# Altium project VETB.PrjPcb
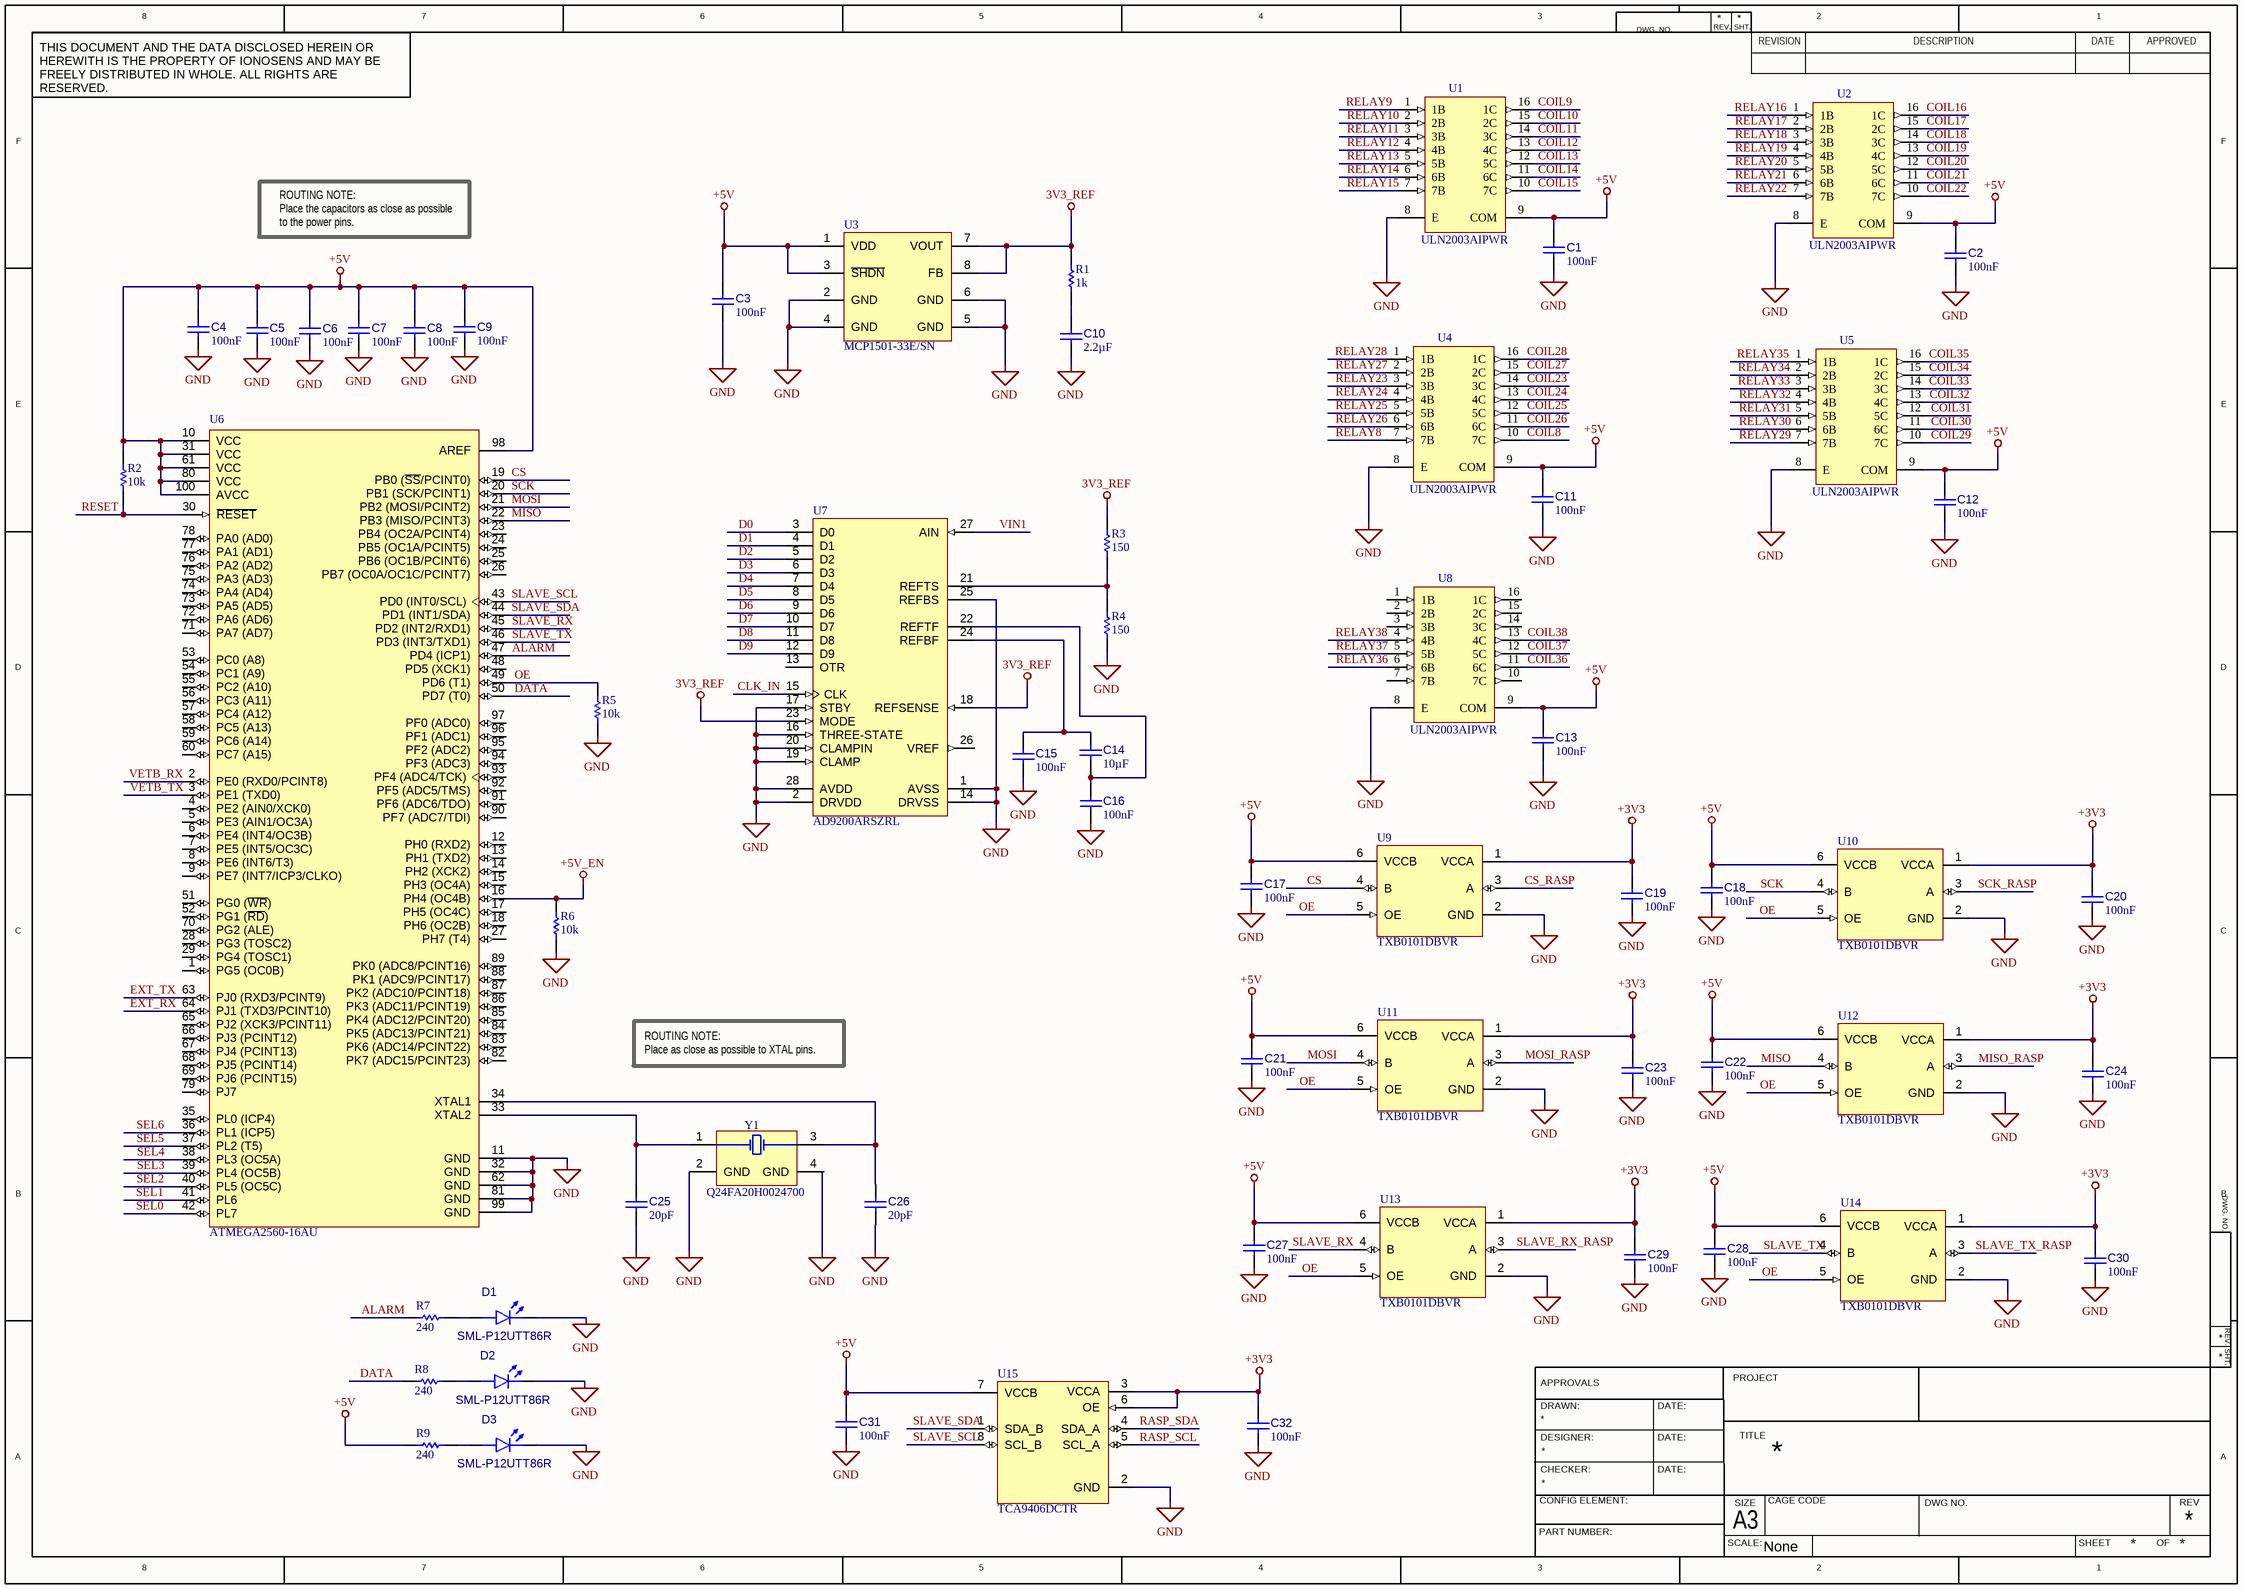
[diagram p0: Sheet1.SchDoc]
3 sheets, 181 parts. Net scope: global (net labels, ports and power ports of the same name join across sheets).
Board file: PCB1.PcbDoc
Sheets:
  Sheet1.SchDoc
  Sheet2.SchDoc
  Sheet3.SchDoc

## Sheet Sheet1.SchDoc
size 420 x 297 mm; Scale: None

### Parts
C1  value 100nF  [CAPC1005X06M]  (hidden comment: CC0402JRX7R7BB104)
C2  value 100nF  [CAPC1005X06M]  (hidden comment: CC0402JRX7R7BB104)
C3  value 100nF  [CAPC1005X06M]  (hidden comment: CC0402JRX7R7BB104)
C4  value 100nF  [CAPC1005X06M]  (hidden comment: CC0402JRX7R7BB104)
C5  value 100nF  [CAPC1005X06M]  (hidden comment: CC0402JRX7R7BB104)
C6  value 100nF  [CAPC1005X06M]  (hidden comment: CC0402JRX7R7BB104)
C7  value 100nF  [CAPC1005X06M]  (hidden comment: CC0402JRX7R7BB104)
C8  value 100nF  [CAPC1005X06M]  (hidden comment: CC0402JRX7R7BB104)
C9  value 100nF  [CAPC1005X06M]  (hidden comment: CC0402JRX7R7BB104)
C10  value 2.2µF  [CAPC2012X14M]  (hidden comment: AC0805KKX7R8BB225)
C11  value 100nF  [CAPC1005X06M]  (hidden comment: CC0402JRX7R7BB104)
C12  value 100nF  [CAPC1005X06M]  (hidden comment: CC0402JRX7R7BB104)
C13  value 100nF  [CAPC1005X06M]  (hidden comment: CC0402JRX7R7BB104)
C14  value 10µF  [CAPC1005X07N]  (hidden comment: CC0402MRX5R6BB106)
C15  value 100nF  [CAPC1005X06M]  (hidden comment: CC0402JRX7R7BB104)
C16  value 100nF  [CAPC1005X06M]  (hidden comment: CC0402JRX7R7BB104)
C17  value 100nF  [CAPC1005X06M]  (hidden comment: CC0402JRX7R7BB104)
C18  value 100nF  [CAPC1005X06M]  (hidden comment: CC0402JRX7R7BB104)
C19  value 100nF  [CAPC1005X06M]  (hidden comment: CC0402JRX7R7BB104)
C20  value 100nF  [CAPC1005X06M]  (hidden comment: CC0402JRX7R7BB104)
C21  value 100nF  [CAPC1005X06M]  (hidden comment: CC0402JRX7R7BB104)
C22  value 100nF  [CAPC1005X06M]  (hidden comment: CC0402JRX7R7BB104)
C23  value 100nF  [CAPC1005X06M]  (hidden comment: CC0402JRX7R7BB104)
C24  value 100nF  [CAPC1005X06M]  (hidden comment: CC0402JRX7R7BB104)
C25  value 20pF  [CAPC1005X06M]  (hidden comment: CC0402JRNPO9BN200)
C26  value 20pF  [CAPC1005X06M]  (hidden comment: CC0402JRNPO9BN200)
C27  value 100nF  [CAPC1005X06M]  (hidden comment: CC0402JRX7R7BB104)
C28  value 100nF  [CAPC1005X06M]  (hidden comment: CC0402JRX7R7BB104)
C29  value 100nF  [CAPC1005X06M]  (hidden comment: CC0402JRX7R7BB104)
C30  value 100nF  [CAPC1005X06M]  (hidden comment: CC0402JRX7R7BB104)
C31  value 100nF  [CAPC1005X06M]  (hidden comment: CC0402JRX7R7BB104)
C32  value 100nF  [CAPC1005X06M]  (hidden comment: CC0402JRX7R7BB104)
D1  SML-P12UTT86R  [DIOC1005X02R]
D2  SML-P12UTT86R  [DIOC1005X02R]
D3  SML-P12UTT86R  [DIOC1005X02R]
R1  value 1k  [RESC1005X04M]  (hidden comment: AC0402FR-071KL)
R2  value 10k  [RESC1005X04M]  (hidden comment: AC0402FR-0710KL)
R3  value 150  [RESC1608X06N]  (hidden comment: AC0603FR-07150RL)
R4  value 150  [RESC1608X06N]  (hidden comment: AC0603FR-07150RL)
R5  value 10k  [RESC1005X04M]  (hidden comment: AC0402FR-0710KL)
R6  value 10k  [RESC1005X04M]  (hidden comment: AC0402FR-0710KL)
R7  value 240  [RESC1005X04M]  (hidden comment: AC0402FR-07240RL)
R8  value 240  [RESC1005X04M]  (hidden comment: AC0402FR-07240RL)
R9  value 240  [RESC1005X04M]  (hidden comment: AC0402FR-07240RL)
U1  ULN2003AIPWR  [TSOP65P640X120-16M]
U2  ULN2003AIPWR  [TSOP65P640X120-16M]
U3  MCP1501-33E/SN  [SOIC127P600X175-8M]
U4  ULN2003AIPWR  [TSOP65P640X120-16M]
U5  ULN2003AIPWR  [TSOP65P640X120-16M]
U6  ATMEGA2560-16AU  [ATML-100A_M]
U7  AD9200ARSZRL  [SOP65P780X198-28N]
U8  ULN2003AIPWR  [TSOP65P640X120-16M]
U9  TXB0101DBVR  [SOT95P280X145-6M]
U10  TXB0101DBVR  [SOT95P280X145-6M]
U11  TXB0101DBVR  [SOT95P280X145-6M]
U12  TXB0101DBVR  [SOT95P280X145-6M]
U13  TXB0101DBVR  [SOT95P280X145-6M]
U14  TXB0101DBVR  [SOT95P280X145-6M]
U15  TCA9406DCTR  [TSOP65P400X130-8M]
Y1  Q24FA20H0024700  [FA-20H]

### Nets
3V3_REF: R1.2 R3.2 U3.7(VOUT) U3.8(FB) U7.18(REFSENSE) U7.23(MODE)
+3V3: C19.2 C20.2 C23.2 C24.2 C29.2 C30.2 C32.2 U9.1(VCCA) U10.1(VCCA) U11.1(VCCA) U12.1(VCCA) U13.1(VCCA) U14.1(VCCA) U15.3(VCCA) U15.6(OE)
+5V: C1.2 C2.2 C3.2 C4.2 C5.2 C6.2 C7.2 C8.2 C9.2 C11.2 C12.2 C13.2 C17.2 C18.2 C21.2 C22.2 C27.2 C28.2 C31.2 R2.2 R9.1 U1.9(COM) U2.9(COM) U3.1(VDD) U3.3(~{SHDN}) U4.9(COM) U5.9(COM) U6.10(VCC) U6.31(VCC) U6.61(VCC) U6.80(VCC) U6.98(AREF) U6.100(AVCC) U8.9(COM) U9.6(VCCB) U10.6(VCCB) U11.6(VCCB) U12.6(VCCB) U13.6(VCCB) U14.6(VCCB) U15.7(VCCB)
+5V_EN: R6.2 U6.16(PH4_(OC4B))
GND: C1.1 C2.1 C3.1 C4.1 C5.1 C6.1 C7.1 C8.1 C9.1 C10.1 C11.1 C12.1 C13.1 C15.1 C16.1 C17.1 C18.1 C19.1 C20.1 C21.1 C22.1 C23.1 C24.1 C25.1 C26.1 C27.1 C28.1 C29.1 C30.1 C31.1 C32.1 D1.1(K) D2.1(K) D3.1(K) R4.1 R5.1 R6.1 U1.8(E) U2.8(E) U3.2(GND) U3.4(GND) U3.5(GND) U3.6(GND) U4.8(E) U5.8(E) U6.11(GND) U6.32(GND) U6.62(GND) U6.81(GND) U6.99(GND) U7.1(AVSS) U7.2(DRVDD) U7.14(DRVSS) U7.16(THREE-STATE) U7.17(STBY) U7.19(CLAMP) U7.20(CLAMPIN) U7.25(REFBS) U7.28(AVDD) U8.8(E) U9.2(GND) U10.2(GND) U11.2(GND) U12.2(GND) U13.2(GND) U14.2(GND) U15.2(GND) Y1.2(GND) Y1.4(GND)
ALARM: R7.1 U6.47(PD4_(ICP1))
CLK_IN: U7.15(CLK)
COIL8: U4.10(7C)
COIL9: U1.16(1C)
COIL10: U1.15(2C)
COIL11: U1.14(3C)
COIL12: U1.13(4C)
COIL13: U1.12(5C)
COIL14: U1.11(6C)
COIL15: U1.10(7C)
COIL16: U2.16(1C)
COIL17: U2.15(2C)
COIL18: U2.14(3C)
COIL19: U2.13(4C)
COIL20: U2.12(5C)
COIL21: U2.11(6C)
COIL22: U2.10(7C)
COIL23: U4.14(3C)
COIL24: U4.13(4C)
COIL25: U4.12(5C)
COIL26: U4.11(6C)
COIL27: U4.15(2C)
COIL28: U4.16(1C)
COIL29: U5.10(7C)
COIL30: U5.11(6C)
COIL31: U5.12(5C)
COIL32: U5.13(4C)
COIL33: U5.14(3C)
COIL34: U5.15(2C)
COIL35: U5.16(1C)
COIL36: U8.11(6C)
COIL37: U8.12(5C)
COIL38: U8.13(4C)
CS: U6.19(PB0_(~{SS}/PCINT0)) U9.4(B)
CS_RASP: U9.3(A)
D0: U7.3(D0)
D1: U7.4(D1)
D2: U7.5(D2)
D3: U7.6(D3)
D4: U7.7(D4)
D5: U7.8(D5)
D6: U7.9(D6)
D7: U7.10(D7)
D8: U7.11(D8)
D9: U7.12(D9)
DATA: R8.1 U6.50(PD7_(T0))
EXT_RX: U6.64(PJ1_(TXD3/PCINT10))
EXT_TX: U6.63(PJ0_(RXD3/PCINT9))
MISO: U6.22(PB3_(MISO/PCINT3)) U12.4(B)
MISO_RASP: U12.3(A)
MOSI: U6.21(PB2_(MOSI/PCINT2)) U11.4(B)
MOSI_RASP: U11.3(A)
OE: R5.2 U6.49(PD6_(T1)) U9.5(OE) U10.5(OE) U11.5(OE) U12.5(OE) U13.5(OE) U14.5(OE)
RASP_SCL: U15.5(SCL_A)
RASP_SDA: U15.4(SDA_A)
RELAY8: U4.7(7B)
RELAY9: U1.1(1B)
RELAY10: U1.2(2B)
RELAY11: U1.3(3B)
RELAY12: U1.4(4B)
RELAY13: U1.5(5B)
RELAY14: U1.6(6B)
RELAY15: U1.7(7B)
RELAY16: U2.1(1B)
RELAY17: U2.2(2B)
RELAY18: U2.3(3B)
RELAY19: U2.4(4B)
RELAY20: U2.5(5B)
RELAY21: U2.6(6B)
RELAY22: U2.7(7B)
RELAY23: U4.3(3B)
RELAY24: U4.4(4B)
RELAY25: U4.5(5B)
RELAY26: U4.6(6B)
RELAY27: U4.2(2B)
RELAY28: U4.1(1B)
RELAY29: U5.7(7B)
RELAY30: U5.6(6B)
RELAY31: U5.5(5B)
RELAY32: U5.4(4B)
RELAY33: U5.3(3B)
RELAY34: U5.2(2B)
RELAY35: U5.1(1B)
RELAY36: U8.6(6B)
RELAY37: U8.5(5B)
RELAY38: U8.4(4B)
RESET: R2.1 U6.30(~{RESET})
SCK: U6.20(PB1_(SCK/PCINT1)) U10.4(B)
SCK_RASP: U10.3(A)
SEL0: U6.42(PL7)
SEL1: U6.41(PL6)
SEL2: U6.40(PL5_(OC5C))
SEL3: U6.39(PL4_(OC5B))
SEL4: U6.38(PL3_(OC5A))
SEL5: U6.37(PL2_(T5))
SEL6: U6.36(PL1_(ICP5))
SLAVE_RX: U6.45(PD2_(INT2/RXD1)) U13.4(B)
SLAVE_RX_RASP: U13.3(A)
SLAVE_SCL: U6.43(PD0_(INT0/SCL)) U15.8(SCL_B)
SLAVE_SDA: U6.44(PD1_(INT1/SDA)) U15.1(SDA_B)
SLAVE_TX: U6.46(PD3_(INT3/TXD1)) U14.4(B)
SLAVE_TX_RASP: U14.3(A)
VETB_RX: U6.2(PE0_(RXD0/PCINT8))
VETB_TX: U6.3(PE1_(TXD0))
VIN1: U7.27(AIN)
NetC10_2: C10.2 R1.1
NetC14_1: C14.1 C16.2 U7.22(REFTF)
NetC14_2: C14.2 C15.2 U7.24(REFBF)
NetC25_2: C25.2 U6.33(XTAL2) Y1.1(X1)
NetC26_2: C26.2 U6.34(XTAL1) Y1.3(X2)
NetD1_2: D1.2(A) R7.2
NetD2_2: D2.2(A) R8.2
NetD3_2: D3.2(A) R9.2
NetR3_1: R3.1 R4.2 U7.21(REFTS)

Not connected (* = marked no-connect by the designer): U6 1(PG5_(OC0B)) 4(PE2_(AIN0/XCK0)) 5(PE3_(AIN1/OC3A)) 6(PE4_(INT4/OC3B)) 7(PE5_(INT5/OC3C)) 8(PE6_(INT6/T3)) 9(PE7_(INT7/ICP3/CLKO)) 12(PH0_(RXD2)) 13(PH1_(TXD2)) 14(PH2_(XCK2)) 15(PH3_(OC4A)) 17(PH5_(OC4C)) 18(PH6_(OC2B)) 23(PB4_(OC2A/PCINT4)) 24(PB5_(OC1A/PCINT5)) 25(PB6_(OC1B/PCINT6)) 26(PB7_(OC0A/OC1C/PCINT7)) 27(PH7_(T4)) 28(PG3_(TOSC2)) 29(PG4_(TOSC1)) 35(PL0_(ICP4)) 48(PD5_(XCK1)) 51(PG0_(~{WR})) 52(PG1_(~{RD})) 53(PC0_(A8)) 54(PC1_(A9)) 55(PC2_(A10)) 56(PC3_(A11)) 57(PC4_(A12)) 58(PC5_(A13)) 59(PC6_(A14)) 60(PC7_(A15)) 65(PJ2_(XCK3/PCINT11)) 66(PJ3_(PCINT12)) 67(PJ4_(PCINT13)) 68(PJ5_(PCINT14)) 69(PJ6_(PCINT15)) 70(PG2_(ALE)) 71(PA7_(AD7)) 72(PA6_(AD6)) 73(PA5_(AD5)) 74(PA4_(AD4)) 75(PA3_(AD3)) 76(PA2_(AD2)) 77(PA1_(AD1)) 78(PA0_(AD0)) 79(PJ7) 82(PK7_(ADC15/PCINT23)) 83(PK6_(ADC14/PCINT22)) 84(PK5_(ADC13/PCINT21)) 85(PK4_(ADC12/PCINT20)) 86(PK3_(ADC11/PCINT19)) 87(PK2_(ADC10/PCINT18)) 88(PK1_(ADC9/PCINT17)) 89(PK0_(ADC8/PCINT16)) 90(PF7_(ADC7/TDI)) 91(PF6_(ADC6/TDO)) 92(PF5_(ADC5/TMS)) 93(PF4_(ADC4/TCK)) 94(PF3_(ADC3)) 95(PF2_(ADC2)) 96(PF1_(ADC1)) 97(PF0_(ADC0)); U7 13(OTR) 26(VREF); U8 1(1B) 2(2B) 3(3B) 7(7B) 10(7C) 14(3C) 15(2C) 16(1C)

### Notes on the sheet
- ROUTING NOTE:
  Place the capacitors as close as possible to the power pins.
- ROUTING NOTE:
  Place as close as possible to XTAL pins.
- 8
- 7
- 6
- 5
- 4
- 3
- DWG. NO.
- REV.
- SHT.
- REVISION
- 2
- DESCRIPTION
- DATE
- 1
- APPROVED
- THIS DOCUMENT AND THE DATA DISCLOSED HEREIN OR HEREWITH IS THE PROPERTY OF IONOSENS AND MAY BE FREELY DISTRIBUTED IN WHOLE. ALL RIGHTS ARE RESERVED.
- F
- E
- D
- C
- B
- DRAWN:
- APPROVALS
- DATE:
- PROJECT
- A
- CHECKER:
- DESIGNER:
- TITLE
- PART NUMBER:
- CONFIG ELEMENT:
- SCALE:
- A3
- SIZE
- CAGE CODE
- DWG NO.
- SHEET
- OF
- REV

### Library data of the parts
C1-C9 C11-C13 C15-C24 C27-C32 = C01-0402-01-00001-1: Cap Ceramic 100nF 50V X7R 5% SMD 0402 125°C; Manufacturer: YAGEO; Voltage Rating: 16V; Case/Package: 0402; Capacitor Type: Ceramic; Min Operating Temperature: -55°C; Width: 508µm; Length: 1mm; Tolerance: 5%; Dielectric: X7R; RoHS Compliant: Yes; Pins: 2; Composition: Ceramic; Depth: 500µm; Voltage Rating (DC): 16V; Mount: Surface Mount; Mounting Technology: Surface Mount; Termination: SMD/SMT; Manufacturer P/N: CC0402JRX7R7BB104; Thickness: 558.8µm; Max Operating Temperature: 125°C
C10 = C01-0402-01-00007-1: Cap Ceramic 2.2uF 25V X7R +-10% SMD 0805 125°C; Manufacturer: YAGEO; Tolerance: 10%; Dielectric: XR7; Max Operating Temperature: 125°C; Composition: Ceramic; Min Operating Temperature: -55°C; Thickness: 711.2µm; Depth: 1.25mm; RoHS Compliant: Yes; Width: 1.2466mm; Mounting Technology: Surface Mount; Case/Package: 0805; Termination: SMD/SMT; Voltage Rating: 25V; Pins: 2; Mount: Surface Mount; Manufacturer P/N: AC0805KKX7R8BB225; Capacitor Type: Ceramic; Length: 2mm; Voltage Rating (DC): 25V
C14 = C01-0402-01-00006-4: Cap Ceramic 10uF 10V XR5 20% SMD 0402 125°C; Manufacturer: YAGEO; Termination: SMD/SMT; RoHS Compliant: Yes; Mounting Technology: Surface Mount; Max Operating Temperature: 125°C; Capacitor Type: Ceramic; Depth: 500µm; Voltage Rating: 10V; Mount: Surface Mount; Thickness: 558.8µm; Length: 990.6µm; Min Operating Temperature: -55°C; Manufacturer P/N: CC0402MRX5R6BB106; Dielectric: XR5; Case/Package: 0402; Voltage Rating (DC): 10V; Composition: Ceramic; Width: 508µm; Tolerance: 20%; Pins: 2
C25 C26 = C01-0402-01-00008-1: Cap Ceramic 20pF 50V C0G 5% SMD 0402 125°C; Manufacturer: YAGEO; Dielectric: COG; Case/Package: 0402; Tolerance: 5%; Thickness: 558.8µm; Termination: SMD/SMT; Manufacturer P/N: CC0402JRNPO9BN200; Voltage Rating: 50V; Length: 990.6µm; Depth: 500µm; Width: 508µm; Min Operating Temperature: -55°C; Mount: Surface Mount; Voltage Rating (DC): 50V; Pins: 2; Capacitor Type: Ceramic; RoHS Compliant: Yes; Composition: Ceramic; Mounting Technology: Surface Mount; Max Operating Temperature: 125°C
D1-D3 = D01-0402-01-00001-1: Led red 0402; Manufacturer: ROHM; Number of LEDs: 1; Max Power Dissipation: 52mW; Luminous Intensity: 85 mcd; Dominant Wavelength: 620 nm; Lens Style: Rectangular, Square; Forward Current: 20 mA; Forward Voltage: 2V; Mounting Technology: SMD; Case/Package: 0402; Min Operating Temperature: -40°C; Max Operating Temperature: 85°C; Manufacturer P/N: SML-P12UTT86R; Colour: red; RoHS Compliant: Yes; Pins: 2
R1 = R01-0402-01-00029-2: RES SMD 1K OHM 1% 1/16W 0402; Manufacturer: Yageo; Power Rating: 62.5mW; Voltage Rating: 50V; Temperature Coefficient: 100 ppm/ºC; Length: 990.6µm; Case/Package: 0402; Features: Automotive AEC-Q200, Moisture Resistant; RoHS: Yes; Packaging: Tape & Reel; Min Operating Temperature: -55°C; Composition: Thick Film; Width: 508µm; Number of Terminations: 2; Tolerance: 1%; Height: 370µm; Manufacturer P/N: AC0402FR-071KL; Max Operating Temperature: 155°C
R2 R5 R6 = R01-0402-01-00169-2: RES SMD 10K OHM 1% 1/16W 0402; Manufacturer: Yageo; Temperature Coefficient: 100 ppm/ºC; Power Rating: 62.5mW; Voltage Rating: 50V; Length: 990.6µm; Height: 370µm; Min Operating Temperature: -55°C; Case/Package: 0402; Features: Automotive AEC-Q200, Moisture Resistant; Packaging: Tape & Reel; Width: 508µm; Manufacturer P/N: AC0402FR-0710KL; RoHS: Yes; Max Operating Temperature: 155°C; Tolerance: 1%; Composition: Thick Film; Number of Terminations: 2
R3 R4 = R01-0603-01-00204-3: RES SMD 150 OHM 1% 1/10W 0603; Manufacturer: Yageo; Temperature Coefficient: 100 ppm/ºC; Voltage Rating: 50V; Power Rating: 100mW; Voltage Rating1: 75V; Case/Package: 0603; Composition: Thick Film; Manufacturer P/N: AC0603FR-07150RL; Features: Automotive AEC-Q200, Moisture Resistant; Tolerance: 1%; RoHS: Yes; Packaging: Tape & Reel; Min Operating Temperature: -55°C; Number of Terminations: 2; Width: 800µm; Max Operating Temperature: 155°C; Length: 1.6002µm; Height: 550µm
R7-R9 = R01-0402-01-00437-2: RES SMD 240 OHM 1% 1/16W 0402; Manufacturer: Yageo; Temperature Coefficient: 100 ppm/ºC; Power Rating: 62.5mW; Voltage Rating: 50V; Packaging: Tape & Reel; Manufacturer P/N: AC0402FR-07240RL; Height: 370µm; Case/Package: 0402; Composition: Thick Film; Max Operating Temperature: 155°C; Number of Terminations: 2; RoHS: Yes; Min Operating Temperature: -55°C; Tolerance: 1%; Width: 508µm; Length: 990.6µm; Features: Automotive AEC-Q200, Moisture Resistant
U1 U2 U4 U5 U8 = CMP-0005-0001-00001-1: 50-V, 7-ch darlington transistor array, -40 to 105C 16-TSSOP -40 to 105; Manufacturer: Texas Instruments; Voltage Rating: 50V; Min Operating Temperature: 105°C; RoHS Compliant: yes; Pins: 16; Case/Package: TSSOP; Mounting Technology: SMD; Length: 5mm; Manufacturer P/N: ULN2003AIPWR; Height: 1.2mm; Max Operating Temperature: -40°C; Width: 4.4mm
U3 = CMP-019-00050-1: V-Ref Precision 3.3V 20mA 8-Pin SOIC; Manufacturer: Microchip; Temperature Coefficient: 50 ppm/°C; Min Supply Voltage: 1.65V; Max Supply Voltage: 5.5V; Tolerance: 0.1 %; Output Voltage: 3.3V; Min Operating Temperature: -40°C; Max Operating Temperature: 125°C; Case/Package: SOIC; Pins: 8; Output Current: 20 mA; RoHS Compliant: yes; Mounting Technology: SMD; Manufacturer P/N: MCP1501-33E/SN
U6 = U01-0007-01-00000-1: AVR ATmega Microcontroller 8-bit 16MHz 256KB FLASH TQFP100; Manufacturer: Microchip; Oscillator Type: External; Interface: I2C, SPI, UART; Minimum Supply Voltage: 4.5V; Peripherals: Brown-out Detect/Reset, POR, PWM, WDT; Number of A/D: 1 AD / 16 channels; Watchdog Timer: Yes; Number of I/O: 86; RAM Size: 8KB; Max Supply Voltage: 5.5V; Max Operating Temperature: 85°C; Manufacturer P/N: ATMEGA2560-16AU; Memory Size: 256KB; Mounting Technology: SMD; Memory Type: FLASH; Pins: 100; Height: 1.2mm; Case/Package: A; RoHS: Yes; Min Operating Temperature: -40°C; Max Frequency: 16MHz; Number of Programmable I/O: 86; Contact Plating: Tin; Core Architecture: AVR; Frequency: 16MHz; Width: 16.25mm
U7 = CMP-0015-00001-3: 1-Channel Single ADC Pipelined 20Msps 10-bit Parallel 28-Pin SSOP; Manufacturer: Analog Devices; Channels: 1; Power: 100mW; Interface: Parallel; Mounting Technology: SMD; Max Operating Temperature: 85°C; Manufacturer P/N: AD9200ARSZRL; Case/Package: SSOP; Min Operating Temperature: -40°C; RoHS Compliant: yes; Pins: 28
U9-U14 = CMP-015-00009-2: Voltage Level Translator 1-CH Bidirectional 6-Pin SOT-23; Manufacturer: Texas Instrument; Min Supply Voltage: 1.2V; Max Supply Voltage: 5.5V; Data rate: 100 Mbps; Mounting Technology: SMD; Min Operating Temperature: -40°C; Pins: 6; Max Operating Temperature: 85°C; Case/Package: SOT-23; RoHS Compliant: yes; Manufacturer P/N: TXB0101DBVR
U15 = CMP-015-00008-2: 2 BIT Bidirectional 1-MHz I2C BUS and SMBus Voltage Level Translator 8-Pin SSOP; Manufacturer: Texas Instrument; Min Supply Voltage: 1.65V; Max Supply Voltage: 5.5V; Min Operating Temperature: -40°C; Manufacturer P/N: TCA9406DCTR; RoHS Compliant: yes; Mounting Technology: SMD; Pins: 8; Case/Package: SSOP8; Max Operating Temperature: 85°C
Y1 = Y01-0001-01-00000-11: 16MHz ±10ppm 16pF 80Ω SMD-2520_4P; Manufacturer: SEIKO-EPSON; ESR: 80; RoHS Compliant: yes; Min Operating Temperature: -40°C; Load Capacitance: 16pF; Mounting Technology: SMD; Pins: 4; Case/Package: SMD-2520_4P; Max Operating Temperature: 85°C; Frequency: 16MHz; Manufacturer P/N: Q24FA20H0024700

## Sheet Sheet2.SchDoc
size 420 x 297 mm
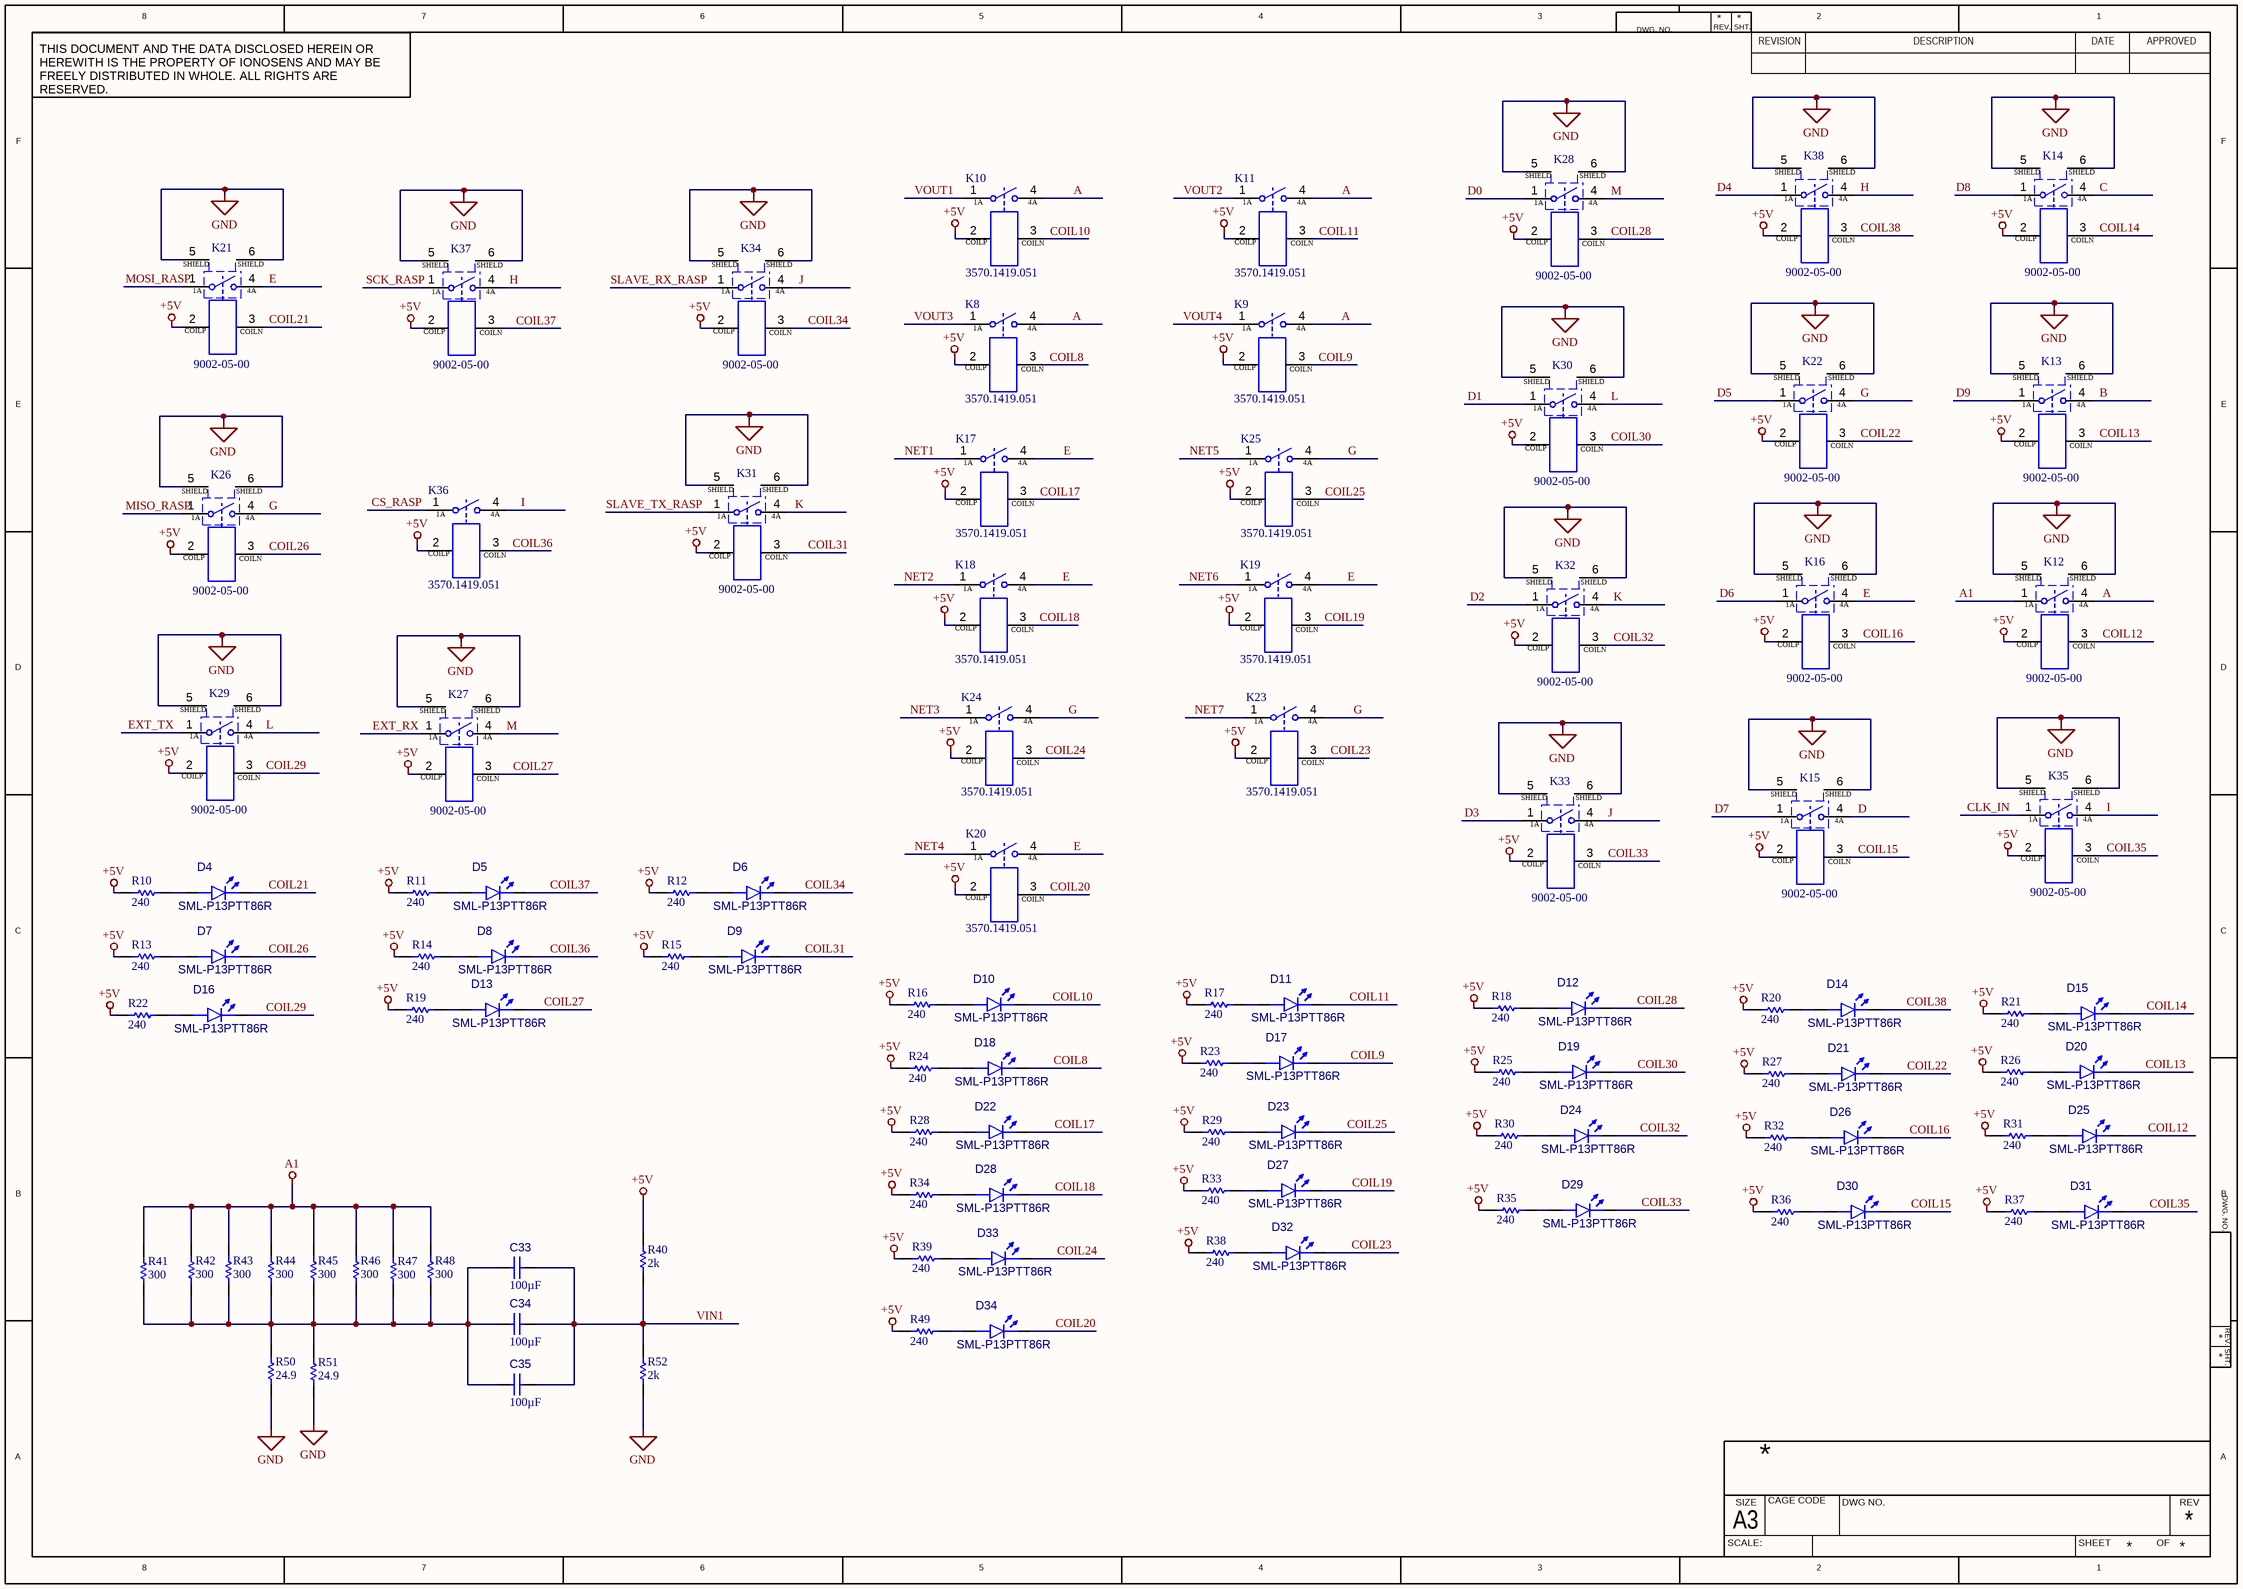
[diagram p1: Sheet2.SchDoc]

### Parts
C33  value 100µF  [CAPC3225X27M]  (hidden comment: EMK325ABJ107MM-P)
C34  value 100µF  [CAPC3225X27M]  (hidden comment: EMK325ABJ107MM-P)
C35  value 100µF  [CAPC3225X27M]  (hidden comment: EMK325ABJ107MM-P)
D4  SML-P13PTT86R  [DIOC1005X02R]
D5  SML-P13PTT86R  [DIOC1005X02R]
D6  SML-P13PTT86R  [DIOC1005X02R]
D7  SML-P13PTT86R  [DIOC1005X02R]
D8  SML-P13PTT86R  [DIOC1005X02R]
D9  SML-P13PTT86R  [DIOC1005X02R]
D10  SML-P13PTT86R  [DIOC1005X02R]
D11  SML-P13PTT86R  [DIOC1005X02R]
D12  SML-P13PTT86R  [DIOC1005X02R]
D13  SML-P13PTT86R  [DIOC1005X02R]
D14  SML-P13PTT86R  [DIOC1005X02R]
D15  SML-P13PTT86R  [DIOC1005X02R]
D16  SML-P13PTT86R  [DIOC1005X02R]
D17  SML-P13PTT86R  [DIOC1005X02R]
D18  SML-P13PTT86R  [DIOC1005X02R]
D19  SML-P13PTT86R  [DIOC1005X02R]
D20  SML-P13PTT86R  [DIOC1005X02R]
D21  SML-P13PTT86R  [DIOC1005X02R]
D22  SML-P13PTT86R  [DIOC1005X02R]
D23  SML-P13PTT86R  [DIOC1005X02R]
D24  SML-P13PTT86R  [DIOC1005X02R]
D25  SML-P13PTT86R  [DIOC1005X02R]
D26  SML-P13PTT86R  [DIOC1005X02R]
D27  SML-P13PTT86R  [DIOC1005X02R]
D28  SML-P13PTT86R  [DIOC1005X02R]
D29  SML-P13PTT86R  [DIOC1005X02R]
D30  SML-P13PTT86R  [DIOC1005X02R]
D31  SML-P13PTT86R  [DIOC1005X02R]
D32  SML-P13PTT86R  [DIOC1005X02R]
D33  SML-P13PTT86R  [DIOC1005X02R]
D34  SML-P13PTT86R  [DIOC1005X02R]
K8  3570.1419.051  [3570.1419]
K9  3570.1419.051  [3570.1419]
K10  3570.1419.051  [3570.1419]
K11  3570.1419.051  [3570.1419]
K12  9002-05-00  [SIP564W40P254L1980H810Q6 - Cloned]
K13  9002-05-00  [SIP564W40P254L1980H810Q6 - Cloned]
K14  9002-05-00  [SIP564W40P254L1980H810Q6 - Cloned]
K15  9002-05-00  [SIP564W40P254L1980H810Q6 - Cloned]
K16  9002-05-00  [SIP564W40P254L1980H810Q6 - Cloned]
K17  3570.1419.051  [3570.1419]
K18  3570.1419.051  [3570.1419]
K19  3570.1419.051  [3570.1419]
K20  3570.1419.051  [3570.1419]
K21  9002-05-00  [SIP564W40P254L1980H810Q6 - Cloned]
K22  9002-05-00  [SIP564W40P254L1980H810Q6 - Cloned]
K23  3570.1419.051  [3570.1419]
K24  3570.1419.051  [3570.1419]
K25  3570.1419.051  [3570.1419]
K26  9002-05-00  [SIP564W40P254L1980H810Q6 - Cloned]
K27  9002-05-00  [SIP564W40P254L1980H810Q6 - Cloned]
K28  9002-05-00  [SIP564W40P254L1980H810Q6 - Cloned]
K29  9002-05-00  [SIP564W40P254L1980H810Q6 - Cloned]
K30  9002-05-00  [SIP564W40P254L1980H810Q6 - Cloned]
K31  9002-05-00  [SIP564W40P254L1980H810Q6 - Cloned]
K32  9002-05-00  [SIP564W40P254L1980H810Q6 - Cloned]
K33  9002-05-00  [SIP564W40P254L1980H810Q6 - Cloned]
K34  9002-05-00  [SIP564W40P254L1980H810Q6 - Cloned]
K35  9002-05-00  [SIP564W40P254L1980H810Q6 - Cloned]
K36  3570.1419.051  [3570.1419]
K37  9002-05-00  [SIP564W40P254L1980H810Q6 - Cloned]
K38  9002-05-00  [SIP564W40P254L1980H810Q6 - Cloned]
R10  value 240  [RESC1005X04M]  (hidden comment: AC0402FR-07240RL)
R11  value 240  [RESC1005X04M]  (hidden comment: AC0402FR-07240RL)
R12  value 240  [RESC1005X04M]  (hidden comment: AC0402FR-07240RL)
R13  value 240  [RESC1005X04M]  (hidden comment: AC0402FR-07240RL)
R14  value 240  [RESC1005X04M]  (hidden comment: AC0402FR-07240RL)
R15  value 240  [RESC1005X04M]  (hidden comment: AC0402FR-07240RL)
R16  value 240  [RESC1005X04M]  (hidden comment: AC0402FR-07240RL)
R17  value 240  [RESC1005X04M]  (hidden comment: AC0402FR-07240RL)
R18  value 240  [RESC1005X04M]  (hidden comment: AC0402FR-07240RL)
R19  value 240  [RESC1005X04M]  (hidden comment: AC0402FR-07240RL)
R20  value 240  [RESC1005X04M]  (hidden comment: AC0402FR-07240RL)
R21  value 240  [RESC1005X04M]  (hidden comment: AC0402FR-07240RL)
R22  value 240  [RESC1005X04M]  (hidden comment: AC0402FR-07240RL)
R23  value 240  [RESC1005X04M]  (hidden comment: AC0402FR-07240RL)
R24  value 240  [RESC1005X04M]  (hidden comment: AC0402FR-07240RL)
R25  value 240  [RESC1005X04M]  (hidden comment: AC0402FR-07240RL)
R26  value 240  [RESC1005X04M]  (hidden comment: AC0402FR-07240RL)
R27  value 240  [RESC1005X04M]  (hidden comment: AC0402FR-07240RL)
R28  value 240  [RESC1005X04M]  (hidden comment: AC0402FR-07240RL)
R29  value 240  [RESC1005X04M]  (hidden comment: AC0402FR-07240RL)
R30  value 240  [RESC1005X04M]  (hidden comment: AC0402FR-07240RL)
R31  value 240  [RESC1005X04M]  (hidden comment: AC0402FR-07240RL)
R32  value 240  [RESC1005X04M]  (hidden comment: AC0402FR-07240RL)
R33  value 240  [RESC1005X04M]  (hidden comment: AC0402FR-07240RL)
R34  value 240  [RESC1005X04M]  (hidden comment: AC0402FR-07240RL)
R35  value 240  [RESC1005X04M]  (hidden comment: AC0402FR-07240RL)
R36  value 240  [RESC1005X04M]  (hidden comment: AC0402FR-07240RL)
R37  value 240  [RESC1005X04M]  (hidden comment: AC0402FR-07240RL)
R38  value 240  [RESC1005X04M]  (hidden comment: AC0402FR-07240RL)
R39  value 240  [RESC1005X04M]  (hidden comment: AC0402FR-07240RL)
R40  value 2k  [RESC1005X04M]  (hidden comment: AC0402FR-072KL)
R41  value 300  [RESC3116X06M]  (hidden comment: AC1206FR-07300RL)
R42  value 300  [RESC3116X06M]  (hidden comment: AC1206FR-07300RL)
R43  value 300  [RESC3116X06M]  (hidden comment: AC1206FR-07300RL)
R44  value 300  [RESC3116X06M]  (hidden comment: AC1206FR-07300RL)
R45  value 300  [RESC3116X06M]  (hidden comment: AC1206FR-07300RL)
R46  value 300  [RESC3116X06M]  (hidden comment: AC1206FR-07300RL)
R47  value 300  [RESC3116X06M]  (hidden comment: AC1206FR-07300RL)
R48  value 300  [RESC3116X06M]  (hidden comment: AC1206FR-07300RL)
R49  value 240  [RESC1005X04M]  (hidden comment: AC0402FR-07240RL)
R50  value 24.9  [RESC3116X06M]  (hidden comment: AC1206FR-0724R9L)
R51  value 24.9  [RESC3116X06M]  (hidden comment: AC1206FR-0724R9L)
R52  value 2k  [RESC1005X04M]  (hidden comment: AC0402FR-072KL)

### Nets
+5V: K8.2(COILP) K9.2(COILP) K10.2(COILP) K11.2(COILP) K12.2(COILP) K13.2(COILP) K14.2(COILP) K15.2(COILP) K16.2(COILP) K17.2(COILP) K18.2(COILP) K19.2(COILP) K20.2(COILP) K21.2(COILP) K22.2(COILP) K23.2(COILP) K24.2(COILP) K25.2(COILP) K26.2(COILP) K27.2(COILP) K28.2(COILP) K29.2(COILP) K30.2(COILP) K31.2(COILP) K32.2(COILP) K33.2(COILP) K34.2(COILP) K35.2(COILP) K36.2(COILP) K37.2(COILP) K38.2(COILP) R10.1 R11.1 R12.1 R13.1 R14.1 R15.1 R16.1 R17.1 R18.1 R19.1 R20.1 R21.1 R22.1 R23.1 R24.1 R25.1 R26.1 R27.1 R28.1 R29.1 R30.1 R31.1 R32.1 R33.1 R34.1 R35.1 R36.1 R37.1 R38.1 R39.1 R40.2 R49.1
A1: K12.1(1A) R41.2 R42.2 R43.2 R44.2 R45.2 R46.2 R47.2 R48.2
GND: K12.5(Shield) K12.6(Shield) K13.5(Shield) K13.6(Shield) K14.5(Shield) K14.6(Shield) K15.5(Shield) K15.6(Shield) K16.5(Shield) K16.6(Shield) K21.5(Shield) K21.6(Shield) K22.5(Shield) K22.6(Shield) K26.5(Shield) K26.6(Shield) K27.5(Shield) K27.6(Shield) K28.5(Shield) K28.6(Shield) K29.5(Shield) K29.6(Shield) K30.5(Shield) K30.6(Shield) K31.5(Shield) K31.6(Shield) K32.5(Shield) K32.6(Shield) K33.5(Shield) K33.6(Shield) K34.5(Shield) K34.6(Shield) K35.5(Shield) K35.6(Shield) K37.5(Shield) K37.6(Shield) K38.5(Shield) K38.6(Shield) R50.1 R51.1 R52.1
A: K8.4(4A) K9.4(4A) K10.4(4A) K11.4(4A) K12.4(4A)
B: K13.4(4A)
C: K14.4(4A)
CLK_IN: K35.1(1A)
COIL8: D18.1(K) K8.3(COILN)
COIL9: D17.1(K) K9.3(COILN)
COIL10: D10.1(K) K10.3(COILN)
COIL11: D11.1(K) K11.3(COILN)
COIL12: D25.1(K) K12.3(COILN)
COIL13: D20.1(K) K13.3(COILN)
COIL14: D15.1(K) K14.3(COILN)
COIL15: D30.1(K) K15.3(COILN)
COIL16: D26.1(K) K16.3(COILN)
COIL17: D22.1(K) K17.3(COILN)
COIL18: D28.1(K) K18.3(COILN)
COIL19: D27.1(K) K19.3(COILN)
COIL20: D34.1(K) K20.3(COILN)
COIL21: D4.1(K) K21.3(COILN)
COIL22: D21.1(K) K22.3(COILN)
COIL23: D32.1(K) K23.3(COILN)
COIL24: D33.1(K) K24.3(COILN)
COIL25: D23.1(K) K25.3(COILN)
COIL26: D7.1(K) K26.3(COILN)
COIL27: D13.1(K) K27.3(COILN)
COIL28: D12.1(K) K28.3(COILN)
COIL29: D16.1(K) K29.3(COILN)
COIL30: D19.1(K) K30.3(COILN)
COIL31: D9.1(K) K31.3(COILN)
COIL32: D24.1(K) K32.3(COILN)
COIL33: D29.1(K) K33.3(COILN)
COIL34: D6.1(K) K34.3(COILN)
COIL35: D31.1(K) K35.3(COILN)
COIL36: D8.1(K) K36.3(COILN)
COIL37: D5.1(K) K37.3(COILN)
COIL38: D14.1(K) K38.3(COILN)
CS_RASP: K36.1(1A)
D: K15.4(4A)
D0: K28.1(1A)
D1: K30.1(1A)
D2: K32.1(1A)
D3: K33.1(1A)
D4: K38.1(1A)
D5: K22.1(1A)
D6: K16.1(1A)
D7: K15.1(1A)
D8: K14.1(1A)
D9: K13.1(1A)
E: K16.4(4A) K17.4(4A) K18.4(4A) K19.4(4A) K20.4(4A) K21.4(4A)
EXT_RX: K27.1(1A)
EXT_TX: K29.1(1A)
G: K22.4(4A) K23.4(4A) K24.4(4A) K25.4(4A) K26.4(4A)
H: K37.4(4A) K38.4(4A)
I: K35.4(4A) K36.4(4A)
J: K33.4(4A) K34.4(4A)
K: K31.4(4A) K32.4(4A)
L: K29.4(4A) K30.4(4A)
M: K27.4(4A) K28.4(4A)
MISO_RASP: K26.1(1A)
MOSI_RASP: K21.1(1A)
NET1: K17.1(1A)
NET2: K18.1(1A)
NET3: K24.1(1A)
NET4: K20.1(1A)
NET5: K25.1(1A)
NET6: K19.1(1A)
NET7: K23.1(1A)
SCK_RASP: K37.1(1A)
SLAVE_RX_RASP: K34.1(1A)
SLAVE_TX_RASP: K31.1(1A)
VIN1: C33.2 C34.2 C35.2 R40.1 R52.2
VOUT1: K10.1(1A)
VOUT2: K11.1(1A)
VOUT3: K8.1(1A)
VOUT4: K9.1(1A)
NetC33_1: C33.1 C34.1 C35.1 R41.1 R42.1 R43.1 R44.1 R45.1 R46.1 R47.1 R48.1 R50.2 R51.2
NetD4_2: D4.2(A) R10.2
NetD5_2: D5.2(A) R11.2
NetD6_2: D6.2(A) R12.2
NetD7_2: D7.2(A) R13.2
NetD8_2: D8.2(A) R14.2
NetD9_2: D9.2(A) R15.2
NetD10_2: D10.2(A) R16.2
NetD11_2: D11.2(A) R17.2
NetD12_2: D12.2(A) R18.2
NetD13_2: D13.2(A) R19.2
NetD14_2: D14.2(A) R20.2
NetD15_2: D15.2(A) R21.2
NetD16_2: D16.2(A) R22.2
NetD17_2: D17.2(A) R23.2
NetD18_2: D18.2(A) R24.2
NetD19_2: D19.2(A) R25.2
NetD20_2: D20.2(A) R26.2
NetD21_2: D21.2(A) R27.2
NetD22_2: D22.2(A) R28.2
NetD23_2: D23.2(A) R29.2
NetD24_2: D24.2(A) R30.2
NetD25_2: D25.2(A) R31.2
NetD26_2: D26.2(A) R32.2
NetD27_2: D27.2(A) R33.2
NetD28_2: D28.2(A) R34.2
NetD29_2: D29.2(A) R35.2
NetD30_2: D30.2(A) R36.2
NetD31_2: D31.2(A) R37.2
NetD32_2: D32.2(A) R38.2
NetD33_2: D33.2(A) R39.2
NetD34_2: D34.2(A) R49.2

### Notes on the sheet
- 8
- 7
- 6
- 5
- 4
- 3
- DWG. NO.
- REV.
- SHT.
- REVISION
- 2
- DESCRIPTION
- DATE
- 1
- APPROVED
- THIS DOCUMENT AND THE DATA DISCLOSED HEREIN OR HEREWITH IS THE PROPERTY OF IONOSENS AND MAY BE FREELY DISTRIBUTED IN WHOLE. ALL RIGHTS ARE RESERVED.
- F
- E
- D
- C
- B
- A
- SCALE:
- A3
- SIZE
- CAGE CODE
- DWG NO.
- SHEET
- OF
- REV
- (in symbol K01-0008-01-00002-6) SHIELD

### Library data of the parts
C33-C35 = C01-0402-01-00002-1: Multilayer Ceramic Capacitors (High dielectric type), 16V, 100 uF, ± 20 %, 1210, X5R, RoHS; Manufacturer: Taiyo Yuden; Tolerance: 20%; Dielectric: XR5; Min Operating Temperature: -55°C; Voltage Rating (DC): 16V; Pins: 2; Composition: Ceramic; Mount: SMD; Manufacturer P/N: EMK325ABJ107MM-P; Capacitor Type: Multilayer Ceramic; Thickness: 2.2m; RoHS Compliant: Yes; Termination: -; Depth: 2.2m; Case/Package: 1210; Max Operating Temperature: 85°C; Voltage Rating: 16V; Length: 3.5m; Width: 2.8m; Mounting Technology: SMD
D4-D34 = D01-0402-01-00000-1: Led green 0402; Manufacturer: ROHM; Forward Voltage: 2.1V; Max Power Dissipation: 52mW; Forward Current: 20 mA; Number of LEDs: 1; Dominant Wavelength: 560 nm; Luminous Intensity: 10 mcd; Lens Style: Rectangular, Square; Min Operating Temperature: -40°C; Mounting Technology: SMD; Colour: Green; Manufacturer P/N: SML-P13PTT86R; Max Operating Temperature: 85°C; Pins: 2; RoHS Compliant: Yes; Case/Package: 0402
K8-K11 K17-K20 K23-K25 K36 = K01-0008-01-00008-1: Reed Relay, Mini SIP, 5 VDC; 1 Form A, 15W, 200 VDC, 1.25A; Manufacturer: Comus; Number of Terminal: 4; Contact Current Rating: 1A; Coil Current: 10mA; Switching Voltage: 200V; Rise time: 0s; Contact Resistence: 0.15; Coil resitence: 500; Operate Time: 350µs; Coil Voltage (DC): 5V; Insulation Resistance: 0; Release Time: 100µs; Manufacturer P/N: 3570.1419.051; Mounting Technology: TH; Contact Material: -; Relay Type: Reed; Width: 15.24mm; Contact Form: 1A; Packaging: SIP; Switching Current: 1A; Pins: 4; Case/Package: SIP; Coil Type: -; Min Operating Temperature: -40°C; RoHS: Yes; Height: 6.98mm; Max Operating Temperature: 85°C
K12-K16 K21 K22 K26-K35 K37 K38 = K01-0008-01-00002-6: Reed Relay 5VDC 350Ohm 0.5A SPST-NO THT; Manufacturer: COTO; Rise time: 350µs; Coil Current: 14.28mA; Release Time: 100µs; Number of Terminal: 6; Contact Form: SPST; Insulation Resistance: 1T; Coil Type: Non-Latching; Coil Voltage (DC): 5V; Contact Current Rating: 500mA; Contact Resistence: 0.2; Switching Voltage: 200V; Coil resitence: 350; Relay Type: RF; Mounting Technology: Through Hole; Case/Package: SIP; Contact Material: Ruthenium; Packaging: Bulk; Width: 19.3mm; Height: 7.6mm; Max Operating Temperature: 85°C; RoHS: Yes; Min Operating Temperature: -20°C; Pins: 6; Switching Current: 500mA; Operate Time: 350µs; Manufacturer P/N: 9002-05-00
R10-R39 R49 = R01-0402-01-00437-2: as R7 on sheet Sheet1; Packaging: Tape & Reel; Manufacturer P/N: AC0402FR-07240RL; Height: 370µm; Case/Package: 0402; Composition: Thick Film; Max Operating Temperature: 155°C; Number of Terminations: 2; RoHS: Yes; Min Operating Temperature: -55°C; Tolerance: 1%; Width: 508µm; Length: 990.6µm; Features: Automotive AEC-Q200, Moisture Resistant
R40 R52 = R01-0402-01-00067-3: RES SMD 2K OHM 1% 1/16W 0402; Manufacturer: Yageo; Voltage Rating: 50V; Power Rating: 62.5mW; Temperature Coefficient: 100 ppm/ºC; Tolerance: 1%; Length: 990.6µm; Width: 508µm; Number of Terminations: 2; Packaging: Tape & Reel; Composition: Thick Film; RoHS: Yes; Height: 370µm; Case/Package: 0402; Manufacturer P/N: AC0402FR-072KL; Features: Automotive AEC-Q200, Moisture Resistant; Min Operating Temperature: -55°C; Max Operating Temperature: 155°C
R41-R48 = R01-1206-01-00248-1: RES SMD 300 OHM 1% 1/4W 1206; Manufacturer: Yageo; Temperature Coefficient: 100 ppm/ºC; Voltage Rating: 150V; Power Rating: 250mW; Number of Terminations: 2; Height: 650µm; Min Operating Temperature: -55°C; Composition: Thick Film; Packaging: Tape & Reel; Length: 3.0988mm; Width: 1.6002mm; Case/Package: 1206; Tolerance: 1%; RoHS: Yes; Features: Automotive AEC-Q200, Moisture Resistant; Max Operating Temperature: 155°C; Manufacturer P/N: AC1206FR-07300RL
R50 R51 = R01-1206-01-00129-1: RES SMD 24.9 OHM 1% 1/4W 1206; Manufacturer: Yageo; Voltage Rating: 150V; Temperature Coefficient: 100 ppm/ºC; Power Rating: 250mW; Max Operating Temperature: 155°C; Length: 3.0988mm; Width: 1.6002mm; Height: 650µm; Features: Automotive AEC-Q200, Moisture Resistant; Packaging: Tape & Reel; Min Operating Temperature: -55°C; Manufacturer P/N: AC1206FR-0724R9L; Tolerance: 1%; Case/Package: 1206; Composition: Thick Film; RoHS: Yes; Number of Terminations: 2

## Sheet Sheet3.SchDoc
size 420 x 297 mm
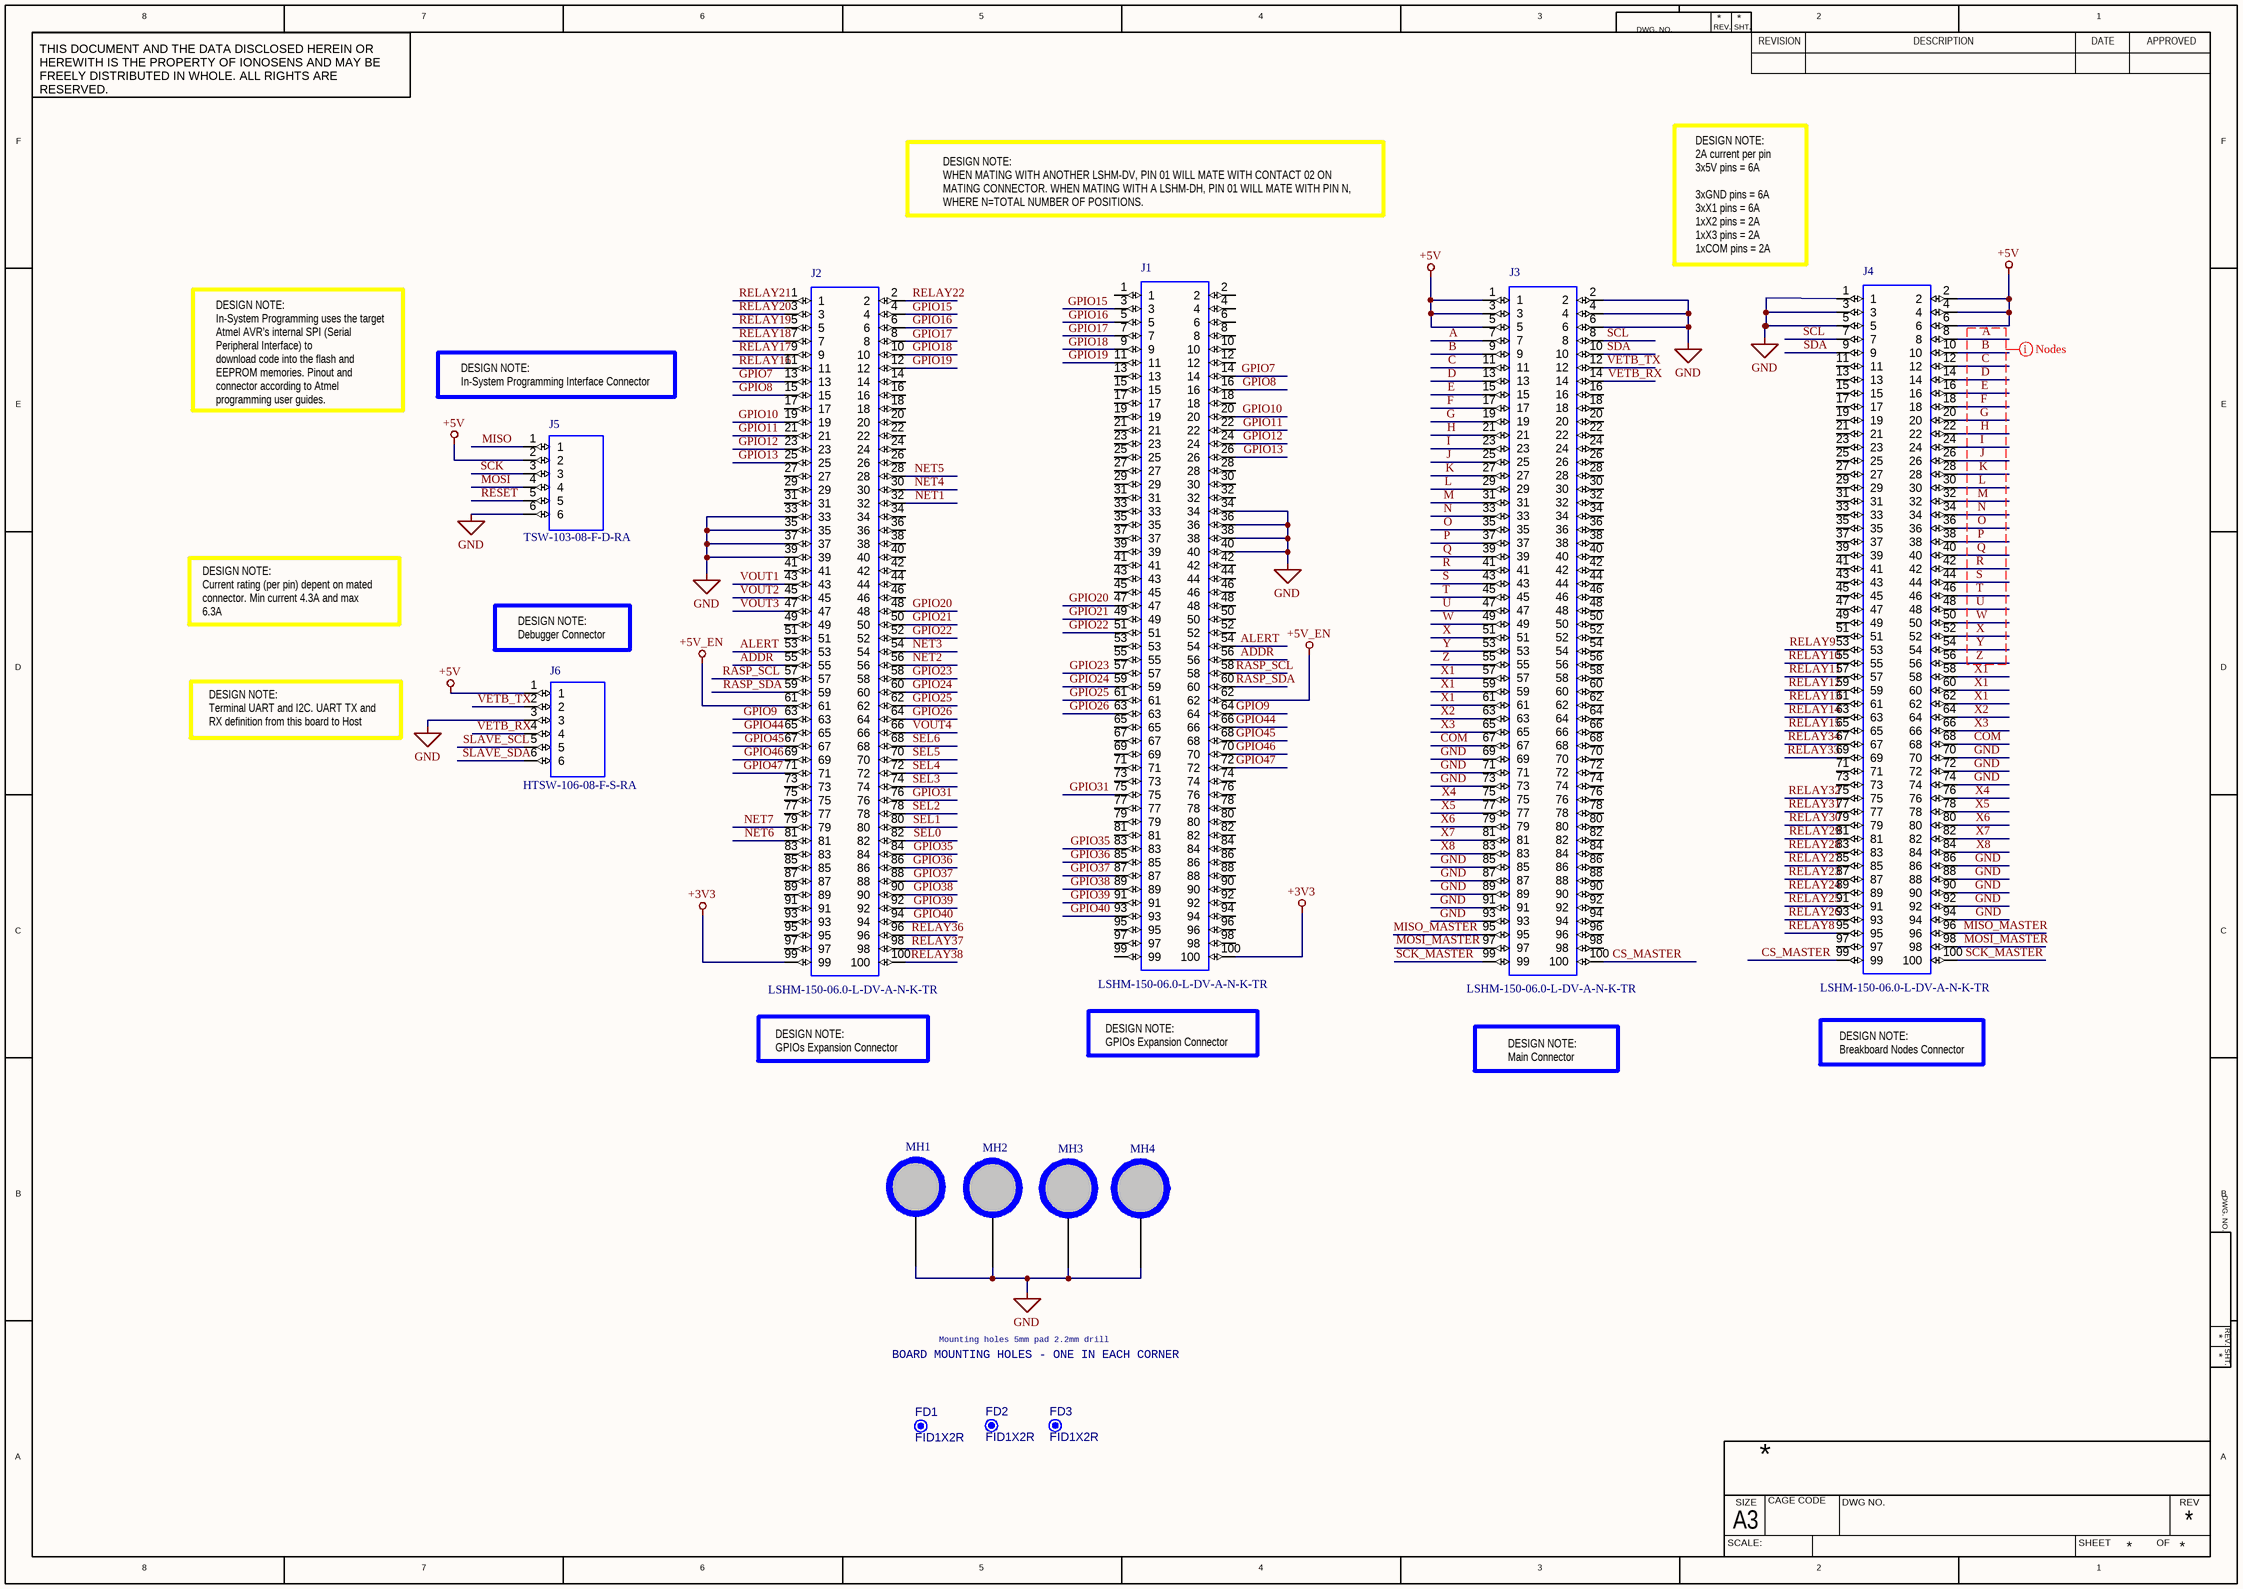
[diagram p2: Sheet3.SchDoc]

### Parts
FD1  FID1X2R  [FID1X2R]  (no BOM)
FD2  FID1X2R  [FID1X2R]  (no BOM)
FD3  FID1X2R  [FID1X2R]  (no BOM)
J1  LSHM-150-06.0-L-DV-A-N-K-TR  [LSHM_150_06_0_L_DV_A_N_K_TR]
J2  LSHM-150-06.0-L-DV-A-N-K-TR  [LSHM_150_06_0_L_DV_A_N_K_TR]
J3  LSHM-150-06.0-L-DV-A-N-K-TR  [LSHM_150_06_0_L_DV_A_N_K_TR]
J4  LSHM-150-06.0-L-DV-A-N-K-TR  [LSHM_150_06_0_L_DV_A_N_K_TR]
J5  TSW-103-08-F-D-RA  [TSW-103-08-F-D-RA]
J6  HTSW-106-08-F-S-RA  [TSW-106-08-F-S-RA]
MH1  C500h220  [C500h220z368]  (value not drawn)
MH2  C500h220  [C500h220z368]  (value not drawn)
MH3  C500h220  [C500h220z368]  (value not drawn)
MH4  C500h220  [C500h220z368]  (value not drawn)

### Nets
+3V3: J1.100 J2.99
+5V: J3.1 J3.3 J3.5 J4.2 J4.4 J4.6 J5.2 J6.1
+5V_EN: J1.62 J2.61
GND: J1.34 J1.36 J1.38 J1.40 J2.33 J2.35 J2.37 J2.39 J3.2 J3.4 J3.6 J3.69 J3.71 J3.73 J3.85 J3.87 J3.89 J3.91 J3.93 J4.1 J4.3 J4.5 J4.70 J4.72 J4.74 J4.86 J4.88 J4.90 J4.92 J4.94 J5.6 J6.3 MH1.1 MH2.1 MH3.1 MH4.1
A: J3.7 J4.8
ADDR: J1.56 J2.55
ALERT: J1.54 J2.53
B: J3.9 J4.10
C: J3.11 J4.12
COM: J3.67 J4.68
CS_MASTER: J3.100 J4.99
D: J3.13 J4.14
E: J3.15 J4.16
F: J3.17 J4.18
G: J3.19 J4.20
GPIO7: J1.14 J2.13
GPIO8: J1.16 J2.15
GPIO9: J1.64 J2.63
GPIO10: J1.20 J2.19
GPIO11: J1.22 J2.21
GPIO12: J1.24 J2.23
GPIO13: J1.26 J2.25
GPIO15: J1.3 J2.4
GPIO16: J1.5 J2.6
GPIO17: J1.7 J2.8
GPIO18: J1.9 J2.10
GPIO19: J1.11 J2.12
GPIO20: J1.47 J2.48
GPIO21: J1.49 J2.50
GPIO22: J1.51 J2.52
GPIO23: J1.57 J2.58
GPIO24: J1.59 J2.60
GPIO25: J1.61 J2.62
GPIO26: J1.63 J2.64
GPIO31: J1.75 J2.76
GPIO35: J1.83 J2.84
GPIO36: J1.85 J2.86
GPIO37: J1.87 J2.88
GPIO38: J1.89 J2.90
GPIO39: J1.91 J2.92
GPIO40: J1.93 J2.94
GPIO44: J1.66 J2.65
GPIO45: J1.68 J2.67
GPIO46: J1.70 J2.69
GPIO47: J1.72 J2.71
H: J3.21 J4.22
I: J3.23 J4.24
J: J3.25 J4.26
K: J3.27 J4.28
L: J3.29 J4.30
M: J3.31 J4.32
MISO: J5.1
MISO_MASTER: J3.95 J4.96
MOSI: J5.4
MOSI_MASTER: J3.97 J4.98
N: J3.33 J4.34
NET1: J2.32
NET2: J2.56
NET3: J2.54
NET4: J2.30
NET5: J2.28
NET6: J2.81
NET7: J2.79
O: J3.35 J4.36
P: J3.37 J4.38
Q: J3.39 J4.40
R: J3.41 J4.42
RASP_SCL: J1.58 J2.57
RASP_SDA: J1.60 J2.59
RELAY8: J4.95
RELAY9: J4.53
RELAY10: J4.55
RELAY11: J4.57
RELAY12: J4.59
RELAY13: J4.61
RELAY14: J4.63
RELAY15: J4.65
RELAY16: J2.11
RELAY17: J2.9
RELAY18: J2.7
RELAY19: J2.5
RELAY20: J2.3
RELAY21: J2.1
RELAY22: J2.2
RELAY23: J4.87
RELAY24: J4.89
RELAY25: J4.91
RELAY26: J4.93
RELAY27: J4.85
RELAY28: J4.83
RELAY29: J4.81
RELAY30: J4.79
RELAY31: J4.77
RELAY32: J4.75
RELAY33: J4.69
RELAY34: J4.67
RELAY36: J2.96
RELAY37: J2.98
RELAY38: J2.100
RESET: J5.5
S: J3.43 J4.44
SCK: J5.3
SCK_MASTER: J3.99 J4.100
SCL: J3.8 J4.7
SDA: J3.10 J4.9
SEL0: J2.82
SEL1: J2.80
SEL2: J2.78
SEL3: J2.74
SEL4: J2.72
SEL5: J2.70
SEL6: J2.68
SLAVE_SCL: J6.5
SLAVE_SDA: J6.6
T: J3.45 J4.46
U: J3.47 J4.48
VETB_RX: J3.14 J6.4
VETB_TX: J3.12 J6.2
VOUT1: J2.43
VOUT2: J2.45
VOUT3: J2.47
VOUT4: J2.66
W: J3.49 J4.50
X: J3.51 J4.52
X1: J3.57 J3.59 J3.61 J4.58 J4.60 J4.62
X2: J3.63 J4.64
X3: J3.65 J4.66
X4: J3.75 J4.76
X5: J3.77 J4.78
X6: J3.79 J4.80
X7: J3.81 J4.82
X8: J3.83 J4.84
Y: J3.53 J4.54
Z: J3.55 J4.56

Not connected (* = marked no-connect by the designer): J1 1 2 4 6 8 10 12 13 15 17 18 19 21 23 25 27 28 29 30 31 32 33 35 37 39 41 42 43 44 45 46 48 50 52 53 55 65 67 69 71 73 74 76 77 78 79 80 81 82 84 86 88 90 92 94 95 96 97 98 99; J2 14 16 17 18 20 22 24 26 27 29 31 34 36 38 40 41 42 44 46 49 51 73 75 77 83 85 87 89 91 93 95 97; J3 16 18 20 22 24 26 28 30 32 34 36 38 40 42 44 46 48 50 52 54 56 58 60 62 64 66 68 70 72 74 76 78 80 82 84 86 88 90 92 94 96 98; J4 11 13 15 17 19 21 23 25 27 29 31 33 35 37 39 41 43 45 47 49 51 71 73 97

### Layout directives
net class Nodes: A, B, C, D, E, F, G, H, I, J, K, L, M, N, O, P, Q, R, S, T, U, W, X, Y, Z

### Notes on the sheet
- DESIGN NOTE:
  WHEN MATING WITH ANOTHER LSHM-DV, PIN 01 WILL MATE WITH CONTACT 02 ON
  MATING CONNECTOR. WHEN MATING WITH A LSHM-DH, PIN 01 WILL MATE WITH PIN N,
  WHERE N=TOTAL NUMBER OF POSITIONS.
- DESIGN NOTE:
  2A current per pin
  3x5V pins = 6A
  3xGND pins = 6A
  3xX1 pins = 6A
  1xX2 pins = 2A
  1xX3 pins = 2A
  1xCOM pins = 2A
- DESIGN NOTE:
  In-System Programming Interface Connector
- DESIGN NOTE:
  In-System Programming uses the target Atmel AVR’s internal SPI (Serial Peripheral Interface) to
  download code into the flash and EEPROM memories. Pinout and connector according to Atmel programming user guides.
- DESIGN NOTE:
  Current rating (per pin) depent on mated connector. Min current 4.3A and max 6.3A
- (near J6) DESIGN NOTE:
  Debugger Connector
- DESIGN NOTE:
  Terminal UART and I2C. UART TX and RX definition from this board to Host
- DESIGN NOTE:
  GPIOs Expansion Connector
- DESIGN NOTE:
  Main Connector
- DESIGN NOTE:
  Breakboard Nodes Connector
- Mounting holes 5mm pad 2.2mm drill
- BOARD MOUNTING HOLES - ONE IN EACH CORNER
- 8
- 7
- 6
- 5
- 4
- 3
- DWG. NO.
- REV.
- SHT.
- REVISION
- 2
- DESCRIPTION
- DATE
- 1
- APPROVED
- THIS DOCUMENT AND THE DATA DISCLOSED HEREIN OR HEREWITH IS THE PROPERTY OF IONOSENS AND MAY BE FREELY DISTRIBUTED IN WHOLE. ALL RIGHTS ARE RESERVED.
- F
- E
- D
- C
- B
- A
- SCALE:
- A3
- SIZE
- CAGE CODE
- DWG NO.
- SHEET
- OF
- REV

### Library data of the parts
FD1-FD3 = CMP-00028-00005-2: Fiducial - Round 1x2mm; Pins: 0
J1-J4 = J01-001-01-00001-2: Conn Socket and Terminal Strip HDR/SKT 100 POS 0.5mm Solder ST SMD T/R; Manufacturer: Samtec; Gender: HERMAPHRODITIC; Pitch: 500 µm; Contact Plating: Gold; Case/Package: SMD; Max Operating Temperature: 125°C; Number of Rows: 2; RoHS Compliant: Yes; Housing Color: Black; Mounting Technology: SMD; Pins: 100; Termination: Solder; Orientation: Straight; Depth: 4.98 mm; Length: 29.7 mm; Contact Material: Bronze; Housing Material: Polymer; Min Operating Temperature: -55°C; Manufacturer P/N: LSHM-150-06.0-L-DV-A-N-K-TR
J5 = J01-001-01-00003-2: 6 Vias Pin Header 2.54mm, Right Angle; Manufacturer: Samtec; Gender: Male; RoHS Compliant: Yes; Min Operating Temperature: -55°C; Case/Package: Through Hole; Termination: Solder; Depth: 4.87 mm; Max Operating Temperature: 125°C; Housing Material: Polyester; Mounting Technology: Through Hole; Number of Rows: 2; Pitch: 2.54mm; Contact Plating: Gold; Contact Material: Bronze; Manufacturer P/N: TSW-103-08-F-D-RA; Pins: 6; Orientation: Straight; Length: 7.62 mm; Housing Color: Black
J6 = J01-001-01-00005-2: 6 Vias Pin Header 2.54mm, Right Angle, 1 Row; Manufacturer: Samtec; Gender: Male; Manufacturer P/N: HTSW-106-08-F-S-RA; Contact Plating: Gold; Length: 7.62 mm; Pins: 6; Housing Material: Polyester; Housing Color: Black; RoHS Compliant: Yes; Case/Package: Through Hole; Pitch: 2.54mm; Mounting Technology: Through Hole; Depth: 4.87 mm; Orientation: Straight; Number of Rows: 2; Contact Material: Bronze; Max Operating Temperature: 125°C; Min Operating Temperature: -55°C; Termination: Solder
MH1-MH4 = CMP-00028-00007-2: hole 5mm pad drill 2.2; Manufacturer: Ionosens; Manufacturer P/N: H5D22; Mounting Technology: Pad; RoHS Compliant: yes; Case/Package: Pad; Min Operating Temperature: 125°C; Pins: 1; Max Operating Temperature: -40°C

## Nets that join several sheets
+3V3: Sheet1 (15 pins), Sheet3 (J1.100 J2.99)
+5V: Sheet1 (41 pins), Sheet2 (63 pins), Sheet3 (8 pins)
+5V_EN: Sheet1 (R6.2 U6.16), Sheet3 (J1.62 J2.61)
GND: Sheet1 (69 pins), Sheet2 (41 pins), Sheet3 (36 pins)
A: Sheet2 (5 pins), Sheet3 (J3.7 J4.8)
B: Sheet2 (K13.4), Sheet3 (J3.9 J4.10)
C: Sheet2 (K14.4), Sheet3 (J3.11 J4.12)
CLK_IN: Sheet1 (U7.15), Sheet2 (K35.1)
COIL8: Sheet1 (U4.10), Sheet2 (D18.1 K8.3)
COIL9: Sheet1 (U1.16), Sheet2 (D17.1 K9.3)
COIL10: Sheet1 (U1.15), Sheet2 (D10.1 K10.3)
COIL11: Sheet1 (U1.14), Sheet2 (D11.1 K11.3)
COIL12: Sheet1 (U1.13), Sheet2 (D25.1 K12.3)
COIL13: Sheet1 (U1.12), Sheet2 (D20.1 K13.3)
COIL14: Sheet1 (U1.11), Sheet2 (D15.1 K14.3)
COIL15: Sheet1 (U1.10), Sheet2 (D30.1 K15.3)
COIL16: Sheet1 (U2.16), Sheet2 (D26.1 K16.3)
COIL17: Sheet1 (U2.15), Sheet2 (D22.1 K17.3)
COIL18: Sheet1 (U2.14), Sheet2 (D28.1 K18.3)
COIL19: Sheet1 (U2.13), Sheet2 (D27.1 K19.3)
COIL20: Sheet1 (U2.12), Sheet2 (D34.1 K20.3)
COIL21: Sheet1 (U2.11), Sheet2 (D4.1 K21.3)
COIL22: Sheet1 (U2.10), Sheet2 (D21.1 K22.3)
COIL23: Sheet1 (U4.14), Sheet2 (D32.1 K23.3)
COIL24: Sheet1 (U4.13), Sheet2 (D33.1 K24.3)
COIL25: Sheet1 (U4.12), Sheet2 (D23.1 K25.3)
COIL26: Sheet1 (U4.11), Sheet2 (D7.1 K26.3)
COIL27: Sheet1 (U4.15), Sheet2 (D13.1 K27.3)
COIL28: Sheet1 (U4.16), Sheet2 (D12.1 K28.3)
COIL29: Sheet1 (U5.10), Sheet2 (D16.1 K29.3)
COIL30: Sheet1 (U5.11), Sheet2 (D19.1 K30.3)
COIL31: Sheet1 (U5.12), Sheet2 (D9.1 K31.3)
COIL32: Sheet1 (U5.13), Sheet2 (D24.1 K32.3)
COIL33: Sheet1 (U5.14), Sheet2 (D29.1 K33.3)
COIL34: Sheet1 (U5.15), Sheet2 (D6.1 K34.3)
COIL35: Sheet1 (U5.16), Sheet2 (D31.1 K35.3)
COIL36: Sheet1 (U8.11), Sheet2 (D8.1 K36.3)
COIL37: Sheet1 (U8.12), Sheet2 (D5.1 K37.3)
COIL38: Sheet1 (U8.13), Sheet2 (D14.1 K38.3)
CS_RASP: Sheet1 (U9.3), Sheet2 (K36.1)
D: Sheet2 (K15.4), Sheet3 (J3.13 J4.14)
D0: Sheet1 (U7.3), Sheet2 (K28.1)
D1: Sheet1 (U7.4), Sheet2 (K30.1)
D2: Sheet1 (U7.5), Sheet2 (K32.1)
D3: Sheet1 (U7.6), Sheet2 (K33.1)
D4: Sheet1 (U7.7), Sheet2 (K38.1)
D5: Sheet1 (U7.8), Sheet2 (K22.1)
D6: Sheet1 (U7.9), Sheet2 (K16.1)
D7: Sheet1 (U7.10), Sheet2 (K15.1)
D8: Sheet1 (U7.11), Sheet2 (K14.1)
D9: Sheet1 (U7.12), Sheet2 (K13.1)
E: Sheet2 (6 pins), Sheet3 (J3.15 J4.16)
EXT_RX: Sheet1 (U6.64), Sheet2 (K27.1)
EXT_TX: Sheet1 (U6.63), Sheet2 (K29.1)
G: Sheet2 (5 pins), Sheet3 (J3.19 J4.20)
H: Sheet2 (K37.4 K38.4), Sheet3 (J3.21 J4.22)
I: Sheet2 (K35.4 K36.4), Sheet3 (J3.23 J4.24)
J: Sheet2 (K33.4 K34.4), Sheet3 (J3.25 J4.26)
K: Sheet2 (K31.4 K32.4), Sheet3 (J3.27 J4.28)
L: Sheet2 (K29.4 K30.4), Sheet3 (J3.29 J4.30)
M: Sheet2 (K27.4 K28.4), Sheet3 (J3.31 J4.32)
MISO: Sheet1 (U6.22 U12.4), Sheet3 (J5.1)
MISO_RASP: Sheet1 (U12.3), Sheet2 (K26.1)
MOSI: Sheet1 (U6.21 U11.4), Sheet3 (J5.4)
MOSI_RASP: Sheet1 (U11.3), Sheet2 (K21.1)
NET1: Sheet2 (K17.1), Sheet3 (J2.32)
NET2: Sheet2 (K18.1), Sheet3 (J2.56)
NET3: Sheet2 (K24.1), Sheet3 (J2.54)
NET4: Sheet2 (K20.1), Sheet3 (J2.30)
NET5: Sheet2 (K25.1), Sheet3 (J2.28)
NET6: Sheet2 (K19.1), Sheet3 (J2.81)
NET7: Sheet2 (K23.1), Sheet3 (J2.79)
RASP_SCL: Sheet1 (U15.5), Sheet3 (J1.58 J2.57)
RASP_SDA: Sheet1 (U15.4), Sheet3 (J1.60 J2.59)
RELAY8: Sheet1 (U4.7), Sheet3 (J4.95)
RELAY9: Sheet1 (U1.1), Sheet3 (J4.53)
RELAY10: Sheet1 (U1.2), Sheet3 (J4.55)
RELAY11: Sheet1 (U1.3), Sheet3 (J4.57)
RELAY12: Sheet1 (U1.4), Sheet3 (J4.59)
RELAY13: Sheet1 (U1.5), Sheet3 (J4.61)
RELAY14: Sheet1 (U1.6), Sheet3 (J4.63)
RELAY15: Sheet1 (U1.7), Sheet3 (J4.65)
RELAY16: Sheet1 (U2.1), Sheet3 (J2.11)
RELAY17: Sheet1 (U2.2), Sheet3 (J2.9)
RELAY18: Sheet1 (U2.3), Sheet3 (J2.7)
RELAY19: Sheet1 (U2.4), Sheet3 (J2.5)
RELAY20: Sheet1 (U2.5), Sheet3 (J2.3)
RELAY21: Sheet1 (U2.6), Sheet3 (J2.1)
RELAY22: Sheet1 (U2.7), Sheet3 (J2.2)
RELAY23: Sheet1 (U4.3), Sheet3 (J4.87)
RELAY24: Sheet1 (U4.4), Sheet3 (J4.89)
RELAY25: Sheet1 (U4.5), Sheet3 (J4.91)
RELAY26: Sheet1 (U4.6), Sheet3 (J4.93)
RELAY27: Sheet1 (U4.2), Sheet3 (J4.85)
RELAY28: Sheet1 (U4.1), Sheet3 (J4.83)
RELAY29: Sheet1 (U5.7), Sheet3 (J4.81)
RELAY30: Sheet1 (U5.6), Sheet3 (J4.79)
RELAY31: Sheet1 (U5.5), Sheet3 (J4.77)
RELAY32: Sheet1 (U5.4), Sheet3 (J4.75)
RELAY33: Sheet1 (U5.3), Sheet3 (J4.69)
RELAY34: Sheet1 (U5.2), Sheet3 (J4.67)
RELAY36: Sheet1 (U8.6), Sheet3 (J2.96)
RELAY37: Sheet1 (U8.5), Sheet3 (J2.98)
RELAY38: Sheet1 (U8.4), Sheet3 (J2.100)
RESET: Sheet1 (R2.1 U6.30), Sheet3 (J5.5)
SCK: Sheet1 (U6.20 U10.4), Sheet3 (J5.3)
SCK_RASP: Sheet1 (U10.3), Sheet2 (K37.1)
SEL0: Sheet1 (U6.42), Sheet3 (J2.82)
SEL1: Sheet1 (U6.41), Sheet3 (J2.80)
SEL2: Sheet1 (U6.40), Sheet3 (J2.78)
SEL3: Sheet1 (U6.39), Sheet3 (J2.74)
SEL4: Sheet1 (U6.38), Sheet3 (J2.72)
SEL5: Sheet1 (U6.37), Sheet3 (J2.70)
SEL6: Sheet1 (U6.36), Sheet3 (J2.68)
SLAVE_RX_RASP: Sheet1 (U13.3), Sheet2 (K34.1)
SLAVE_SCL: Sheet1 (U6.43 U15.8), Sheet3 (J6.5)
SLAVE_SDA: Sheet1 (U6.44 U15.1), Sheet3 (J6.6)
SLAVE_TX_RASP: Sheet1 (U14.3), Sheet2 (K31.1)
VETB_RX: Sheet1 (U6.2), Sheet3 (J3.14 J6.4)
VETB_TX: Sheet1 (U6.3), Sheet3 (J3.12 J6.2)
VIN1: Sheet1 (U7.27), Sheet2 (5 pins)
VOUT1: Sheet2 (K10.1), Sheet3 (J2.43)
VOUT2: Sheet2 (K11.1), Sheet3 (J2.45)
VOUT3: Sheet2 (K8.1), Sheet3 (J2.47)
VOUT4: Sheet2 (K9.1), Sheet3 (J2.66)